# Altium schematic sheet Switch.SchDoc
size A4; SheetNumber: 3; SheetTotal: 3
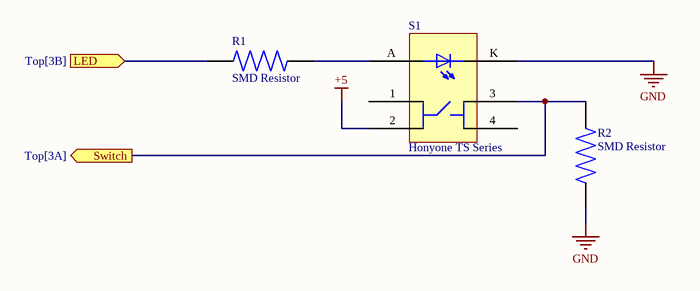
[diagram p0: Switch.SchDoc]

## Parts
R1  SMD Resistor  [SMD Resistor]
R2  SMD Resistor  [SMD Resistor]
S1  Honyone TS Series  [Honyone TS Series]

## Ports
LED (in, see Top[3B]), Switch (out, see Top[3A])

## Nets
+5: S1.2
GND: R2.2 S1.K
LED: R1.1 ; port LED
Switch: R2.1 S1.3 ; port Switch
NetR1_2: R1.2 S1.A

Not connected (* = marked no-connect by the designer): S1 1 4

## Library data of the parts
R1 R2 = CMP-009-000002-1: Source: Basic.SchLib; Design Item ID: SMD Resistor
S1 = CMP-012-000009-3: Design Item ID: Honyone TS Series; Source: Basic.SchLib